# EAGLE design MCU_V3 (EAGLE 7.6.0)
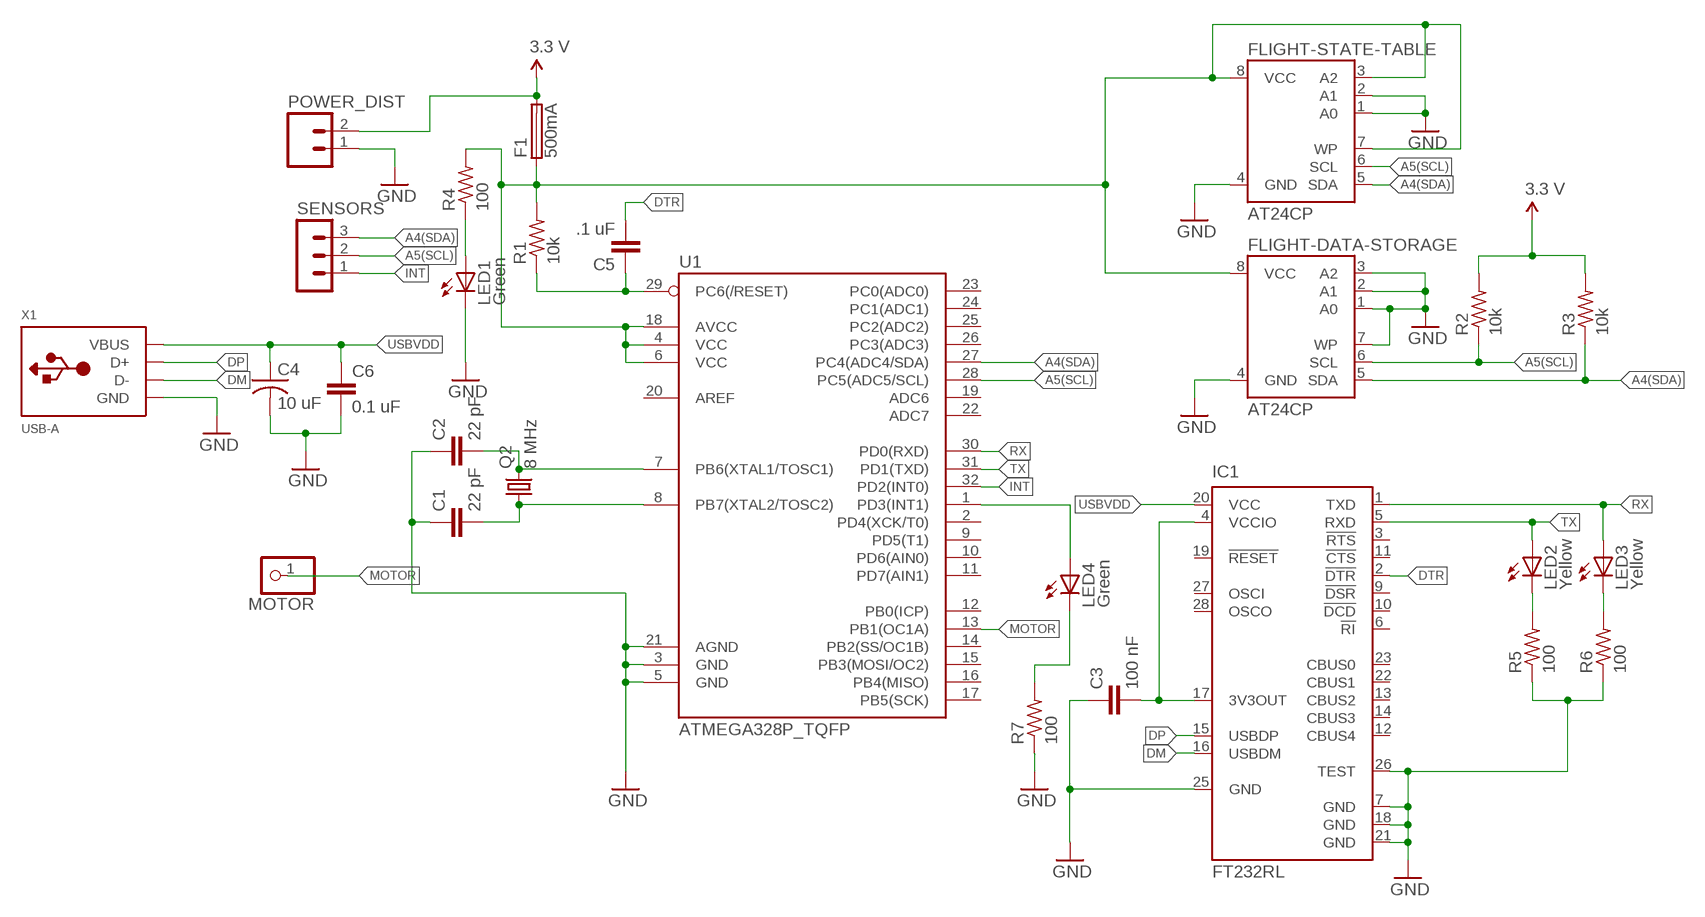
[diagram p0: schematic, sheet 1]

## Parts
C1  22 pF  C2,5-3  [C2.5-3]
C2  22 pF  C2,5-3  [C2.5-3]
C3  100 nF  C2,5-3  [C2.5-3]
C4  10 uF  C-US025-024X044  [C025-024X044]
C5  .1 uF  C2,5-3  [C2.5-3]
C6  0.1 uF  C2,5-3  [C2.5-3]
F1  500mA  PICOFUSE  [PICOFUSE]
FLIGHT-DATA-STORAGE  AT24CP  [DIL08]
FLIGHT-STATE-TABLE  AT24CP  [DIL08]
IC1  FT232RL  [SSOP28]
LED1  Green  LED_ESML0603  [LED_SML0603]
LED2  Yellow  LED_ESML0603  [LED_SML0603]
LED3  Yellow  LED_ESML0603  [LED_SML0603]
LED4  Green  LED_ESML0603  [LED_SML0603]
MOTOR  PINHD-1X1  [1X01]
POWER_DIST  M02PTH  [1X02]
Q2  8 MHz  CRYSTALHC49S  [HC49/S]
R1  10k  R-US_R0805  [R0805]
R2  10k  R-US_R0805  [R0805]
R3  10k  R-US_R0805  [R0805]
R4  100  R-US_R0805  [R0805]
R5  100  R-US_R0805  [R0805]
R6  100  R-US_R0805  [R0805]
R7  100  R-US_R0805  [R0805]
SENSORS  MA03-1  [MA03-1]
U1  ATMEGA328P_TQFP  [TQFP32-08]
X1  USB-A  [MOLEX_480371000]

## Nets
A4(SDA): FLIGHT-DATA-STORAGE.5(SDA) FLIGHT-STATE-TABLE.5(SDA) R3.1 SENSORS.3 U1.27(PC4(ADC4/SDA))
A5(SCL): FLIGHT-DATA-STORAGE.6(SCL) FLIGHT-STATE-TABLE.6(SCL) R2.1 SENSORS.2 U1.28(PC5(ADC5/SCL))
DM: IC1.16(USBDM) X1.2(D-)
DP: IC1.15(USBDP) X1.3(D+)
DTR: C5.2 IC1.2(!DTR)
GND: C1.1 C2.1 C3.1 C4.2 C6.2 FLIGHT-DATA-STORAGE.1(A0) FLIGHT-DATA-STORAGE.2(A1) FLIGHT-DATA-STORAGE.3(A2) FLIGHT-DATA-STORAGE.4(GND) FLIGHT-DATA-STORAGE.7(WP) FLIGHT-STATE-TABLE.1(A0) FLIGHT-STATE-TABLE.2(A1) FLIGHT-STATE-TABLE.4(GND) IC1.7(GND) IC1.18(GND) IC1.21(GND) IC1.25(GND) IC1.26(TEST) LED1.C POWER_DIST.1 R5.1 R6.1 R7.1 U1.3(GND) U1.5(GND) U1.21(AGND) X1.4(GND)
INT: SENSORS.1 U1.32(PD2(INT0))
MOTOR: MOTOR.1 U1.13(PB1(OC1A))
N$1: C5.1 R1.1 U1.29(PC6(/RESET))
N$2: C2.2 Q2.2 U1.7(PB6(XTAL1/TOSC1))
N$3: C1.2 Q2.1 U1.8(PB7(XTAL2/TOSC2))
N$4: LED4.A U1.1(PD3(INT1))
N$5: F1.1 FLIGHT-DATA-STORAGE.8(VCC) FLIGHT-STATE-TABLE.3(A2) FLIGHT-STATE-TABLE.7(WP) FLIGHT-STATE-TABLE.8(VCC) R1.2 R4.2 U1.4(VCC) U1.6(VCC) U1.18(AVCC)
N$6: LED1.A R4.1
N$7: C3.2 IC1.4(VCCIO) IC1.17(3V3OUT)
N$8: LED4.C R7.2
N$9: LED2.C R5.2
N$10: LED3.C R6.2
RX: IC1.1(TXD) LED3.A U1.30(PD0(RXD))
TX: IC1.5(RXD) LED2.A U1.31(PD1(TXD))
USBVDD: C4.1 C6.1 IC1.20(VCC) X1.1(VBUS)
VDD: F1.2 POWER_DIST.2 R2.2 R3.2 ; supply symbol labelled 3.3 V
Unconnected: IC1.3(!RTS) IC1.6(!RI) IC1.9(!DSR) IC1.10(!DCD) IC1.11(!CTS) IC1.12(CBUS4) IC1.13(CBUS2) IC1.14(CBUS3) IC1.19(!RESET) IC1.22(CBUS1) IC1.23(CBUS0) IC1.27(OSCI) IC1.28(OSCO) U1.2(PD4(XCK/T0)) U1.9(PD5(T1)) U1.10(PD6(AIN0)) U1.11(PD7(AIN1)) U1.12(PB0(ICP)) U1.14(PB2(SS/OC1B)) U1.15(PB3(MOSI/OC2)) U1.16(PB4(MISO)) U1.17(PB5(SCK)) U1.19(ADC6) U1.20(AREF) U1.22(ADC7) U1.23(PC0(ADC0)) U1.24(PC1(ADC1)) U1.25(PC2(ADC2)) U1.26(PC3(ADC3))

## Library data of the parts
C1-C3 C5 C6 = capacitor-wima:C: CAPACITOR naming: grid - package width
C4 = adafruit:C-US: CAPACITOR, American symbol
F1 = fuse:PICOFUSE: PICOFUSE 19275, Wickmann; OC_FARNELL: unknown; OC_NEWARK: unknown
FLIGHT-DATA-STORAGE FLIGHT-STATE-TABLE = atmel:AT24C*: 2-wire serial EEPROM; MPN: AT24C1024BW-SH-B; OC_FARNELL: 1362646; OC_NEWARK: 03P2044
IC1 = ftdichip:FT232R: Source: http://www.ftdichip.com/Documents/DataSheets/DS_FT232R_v104.pdf; MPN: FT232RL; OC_FARNELL: 1146032; OC_NEWARK: 91K9918
LED1-LED4 = eagle-ltspice:LED_E: LED Source: http://www.osram.convergy.de Source: www.luxeon.com Source: www.kingbright.com; SPICEMODEL: NONE; SPICEPREFIX: D; SPICETYPE: diode
MOTOR = adafruit:PINHD-1X1: Pin header 1x1 for 0.1" spacing With round pins
POWER_DIST = SparkFun-Connectors:M02: Standard 2-pin 0.1" header. Use with - straight break away headers ( PRT-00116) - right angle break away headers (PRT-00553) - swiss pins (PRT-00743) - machine pins (PRT-00117) - female headers (PRT-00115) Molex polarized connector foot print use with: PRT-08233 with associated crimp pins and housings. 2.54_SCREWTERM for use with PRT-10571. 3.5mm Screw Terminal footprints for PRT-08084 5mm Screw Terminal footprints for use with PRT-08432
Q2 = adafruit:CRYSTAL: CRYSTAL; OC_FARNELL: 1667008; OC_NEWARK: unknown
R1-R7 = resistor:R-US_: RESISTOR, American symbol
SENSORS = con-lstb:MA03-1: PIN HEADER; OC_FARNELL: unknown; OC_NEWARK: unknown
U1 = SparkFun-DigitalIC:ATMEGA328P_TQFP; PROD_ID: IC-09069
X1 = adafruit:USB-A: USB type A 'plug' Used for things that can directly connect to a USB port, say USB key

## Board
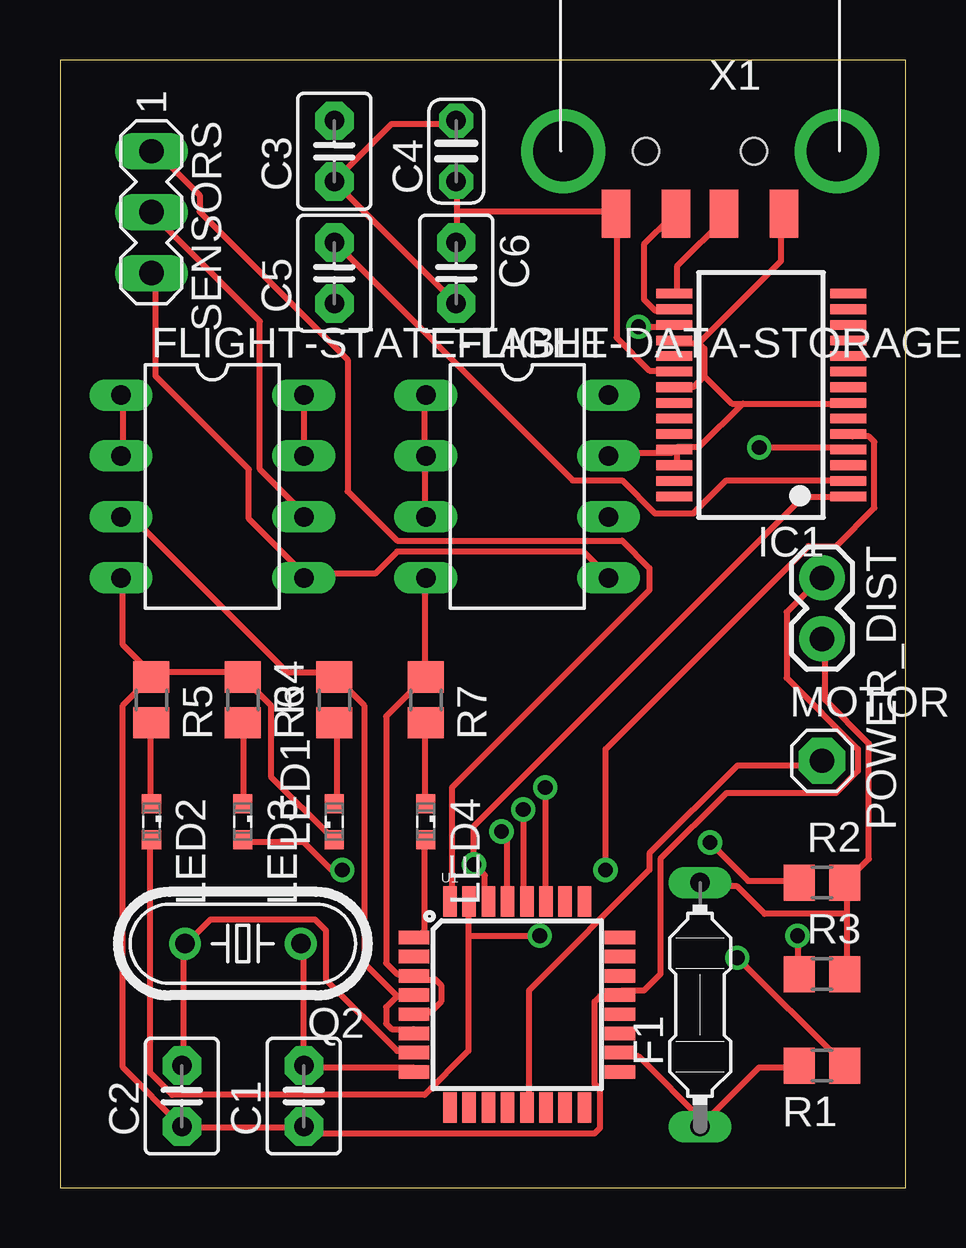
[diagram p1: board, top side]
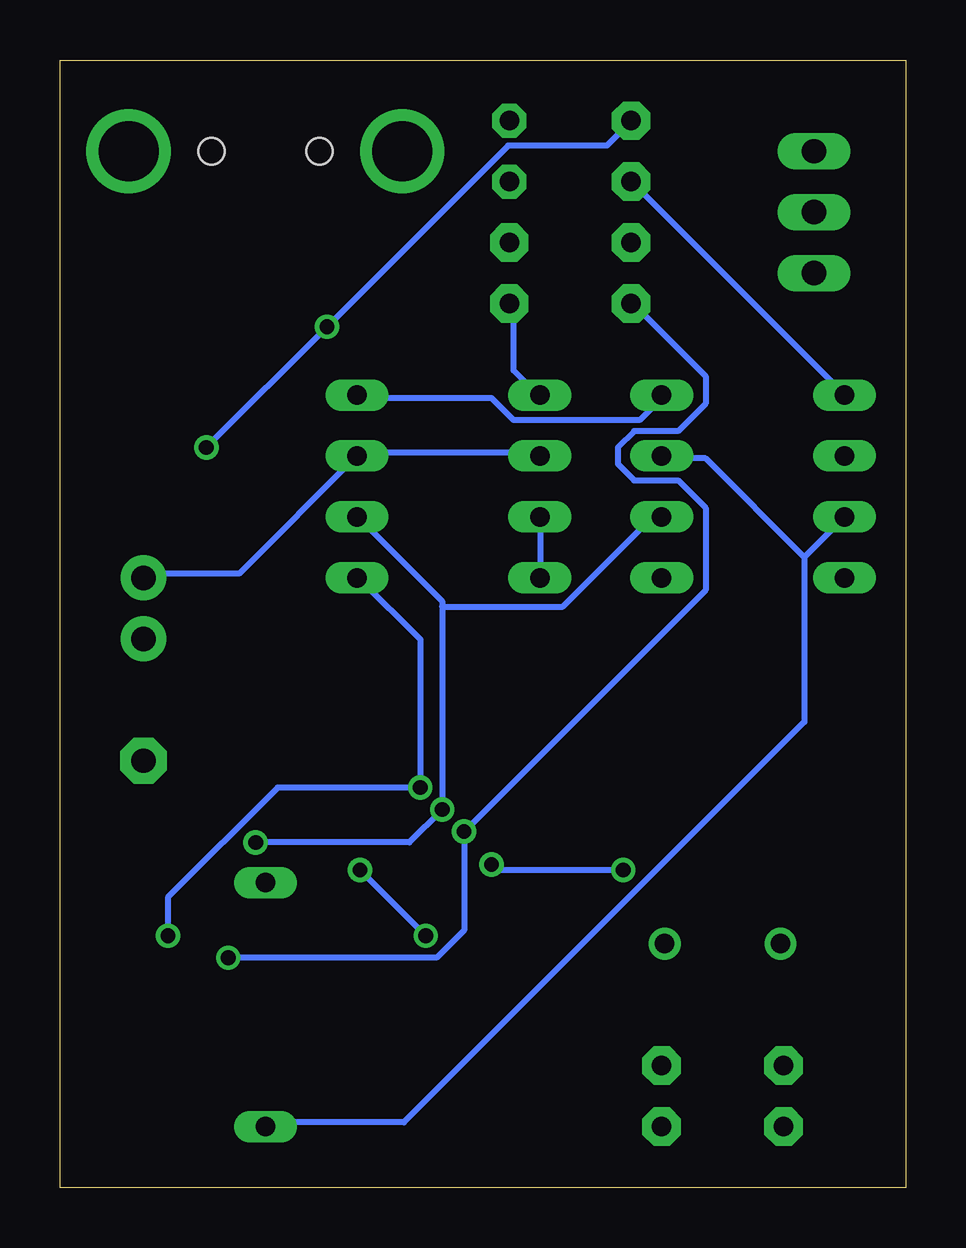
[diagram p2: board, bottom side, seen from below]

Size 35.23 x 46.98 mm. Coordinates in mm from the lower left corner, seen from the top.
Outline: 0,0 35.23,0 35.23,46.98 0,46.98 0,0
Copper layers (1*16): Top 0.035mm / dielectric 1.5mm / Bottom 0.035mm
Design rules "default": minimum track width 10mil, minimum drill 24mil, track to track 8mil, track to pad 8mil, pad to pad 8mil, via to via 8mil, smd to smd 8mil, copper to edge 40mil, drill to drill 8mil, minimum pad ring 10mil, minimum via ring 8mil, stop-mask expansion 4mil, vias tented up to drill 0mil, thermal gap 10mil

### Footprints (pad centres in the part's own frame; a part is rotated, then mirrored left to right if it is on the bottom)
C2.5-3 = drill 0.813 pad 1.6 octagon: 1 -1.27,0; 2 1.27,0
C025-024X044 = drill 0.813 pad 1.422 octagon: 1 -1.27,0; 2 1.27,0
PICOFUSE = drill 0.813 long: 1 -5.08,0; 2 5.08,0
DIL08 = drill 0.813 long: 1 -3.81,-3.81; 2 -1.27,-3.81; 3 1.27,-3.81; 4 3.81,-3.81; 5 3.81,3.81; 6 1.27,3.81; 7 -1.27,3.81; 8 -3.81,3.81
SSOP28 = smd 0.4 x 1.5: 1 -4.225,-3.625; 2 -3.575,-3.625; 3 -2.925,-3.625; 4 -2.275,-3.625; 5 -1.625,-3.625; 6 -0.975,-3.625; 7 -0.325,-3.625; 8 0.325,-3.625; 9 0.975,-3.625; 10 1.625,-3.625; 11 2.275,-3.625; 12 2.925,-3.625; 13 3.575,-3.625; 14 4.225,-3.625; 15 4.225,3.625; 16 3.575,3.625; 17 2.925,3.625; 18 2.275,3.625; 19 1.625,3.625; 20 0.975,3.625; 21 0.325,3.625; 22 -0.325,3.625; 23 -0.975,3.625; 24 -1.625,3.625; 25 -2.275,3.625; 26 -2.925,3.625; 27 -3.575,3.625; 28 -4.225,3.625
LED_SML0603 = smd 0.8 x 0.8: A 0.75,0; C -0.75,0
1X01 = drill 1.016 pad 1.93 octagon: 1 0,0
1X02 = drill 1.016 pad 1.88: 1 0,0; 2 2.54,0
HC49/S = drill 0.813: 1 -2.413,0; 2 2.413,0
R0805 = smd 1.3 x 1.5: 1 -0.95,0; 2 0.95,0
MA03-1 = drill 1.016 long: 1 -2.54,0; 2 0,0; 3 2.54,0
TQFP32-08 = smd 1.27 x 0.559: 1 -4.293,2.8; 2 -4.293,2; 3 -4.293,1.2; 4 -4.293,0.4; 5 -4.293,-0.4; 6 -4.293,-1.2; 7 -4.293,-2; 8 -4.293,-2.8; 17 4.293,-2.8; 18 4.293,-2; 19 4.293,-1.2; 20 4.293,-0.4; 21 4.293,0.4; 22 4.293,1.2; 23 4.293,2; 24 4.293,2.8 | smd 0.559 x 1.27: 9 -2.8,-4.293; 10 -2,-4.293; 11 -1.2,-4.293; 12 -0.4,-4.293; 13 0.4,-4.293; 14 1.2,-4.293; 15 2,-4.293; 16 2.8,-4.293; 25 2.8,4.293; 26 2,4.293; 27 1.2,4.293; 28 0.4,4.293; 29 -0.4,4.293; 30 -1.2,4.293; 31 -2,4.293; 32 -2.8,4.293
MOLEX_480371000 = smd 1.2 x 2: 1 3.5,2.6; 2 1,2.6; 3 -1,2.6; 4 -3.5,2.6 | drill 2.5: M1 -5.7,0; M2 5.7,0 | hole 1.1: -2.25,0; 2.25,0

### Placement (x,y rotation side)
C1  10.16,3.81 90 top
C2  5.08,3.81 90 top
C3  11.43,43.18 90 top
C4  16.51,43.18 90 top
C5  11.43,38.1 90 top
C6  16.51,38.1 270 top
F1  26.67,7.62 90 top
FLIGHT-DATA-STORAGE  19.05,29.21 270 top
FLIGHT-STATE-TABLE  6.35,29.21 270 top
IC1  29.21,33.02 90 top
LED1  11.43,15.24 90 top
LED2  3.81,15.24 270 top
LED3  7.62,15.24 270 top
LED4  15.24,15.24 270 top
MOTOR  31.75,17.78 0 top
POWER_DIST  31.75,25.4 270 top
Q2  7.62,10.16 180 top
R1  31.75,5.08 180 top
R2  31.75,12.7 0 top
R3  31.75,8.89 0 top
R4  11.43,20.32 90 top
R5  3.81,20.32 270 top
R6  7.62,20.32 270 top
R7  15.24,20.32 270 top
SENSORS  3.81,40.64 270 top
U1  19.05,7.62 0 top
X1  26.67,43.18 180 top

### Tracks (layer width: path | path; a pad name or v marks a point on that pad's centre or on a via)
A4(SDA)  (via drill 0.61)
  Top 0.254: v20.22,16.66 20.22,12.09 U1.27 | v30.73,10.49 30.73,8.89 R3.1 | 10.16,25.58 13.13,25.58 14.05,26.49 21.82,26.49 22.73,25.58 FLIGHT-DATA-STORAGE.5 | 10.16,25.58 7.87,27.86 7.87,29.92 3.99,33.81 3.99,37.92 SENSORS.3 | 10.16,25.58 FLIGHT-STATE-TABLE.5
  Bottom 0.254: FLIGHT-DATA-STORAGE.5 22.73,25.35 20.22,22.84 v20.22,16.66 26.16,16.66 30.73,12.09 v30.73,10.49
A5(SCL)  (via drill 0.61)
  Top 0.254: v19.3,15.75 19.3,12.09 U1.28 | v27.08,14.38 28.68,12.78 30.73,12.78 R2.1 | SENSORS.2 3.99,40.44 8.33,36.09 8.33,29.92 10.16,28.09 FLIGHT-STATE-TABLE.6
  Bottom 0.254: 19.3,24.21 19.3,24.44 22.73,27.86 FLIGHT-DATA-STORAGE.6 | 19.3,24.21 v19.3,15.75 20.68,14.38 v27.08,14.38 | 19.3,24.21 14.28,24.21 10.62,27.86 10.16,27.86 FLIGHT-STATE-TABLE.6
DM
  Top 0.254: IC1.16 25.48,36.55 24.79,36.55 24.33,37.01 24.33,39.29 25.48,40.44 X1.2
DP
  Top 0.254: IC1.15 25.71,37.24 25.71,38.38 27.76,40.44 X1.3
DTR
  Top 0.254: IC1.2 32.79,29.46 27.76,29.46 26.39,28.09 24.79,28.09 23.42,29.46 21.36,29.46 11.53,39.29 C5.2
GND
  Top 0.254: LED1.C 11.3,14.61 8.79,17.12 8.79,20.09 7.64,21.23 R6.1 7.42,21.46 3.99,21.46 R5.1 | FLIGHT-STATE-TABLE.4 2.62,25.35 2.62,22.61 3.76,21.46 R5.1 | 10.16,2.49 10.39,2.26 22.28,2.26 22.5,2.49 22.5,4.09 22.28,4.32 22.28,7.75 22.5,7.98 23.19,7.98 U1.21 23.42,8.2 24.33,8.2 25.02,8.89 25.02,13.69 27.76,16.43 32.33,16.43 33.25,17.35 33.25,18.26 30.28,21.23 30.28,23.98 31.65,25.35 POWER_DIST.1 | 10.16,2.49 5.13,2.49 C2.1 2.62,5 2.62,20.09 3.76,21.23 R5.1 | 10.16,2.49 C1.1 | FLIGHT-STATE-TABLE.2 2.62,30.61 2.62,32.89 FLIGHT-STATE-TABLE.1 | C4.2 16.33,44.32 13.82,44.32 11.53,42.04 C3.1 C6.2 | IC1.26 25.71,30.15 25.71,30.61 IC1.25 | IC1.25 25.48,30.61 22.96,30.61 FLIGHT-DATA-STORAGE.7 | 26.85,33.81 26.39,33.35 25.71,33.35 IC1.21 | 26.85,33.81 26.85,34.95 26.62,35.18 | 26.62,35.18 25.71,35.18 IC1.18 | 28.45,32.66 27.99,32.66 26.85,33.81 | 28.45,32.66 32.79,32.66 IC1.7 | 26.62,35.18 30.05,38.61 30.05,40.44 X1.4 | 28.45,32.66 26.62,30.84 25.71,30.84 IC1.25 | FLIGHT-DATA-STORAGE.3 15.19,28.09 15.19,30.38 FLIGHT-DATA-STORAGE.2 15.19,30.61 15.19,32.89 FLIGHT-DATA-STORAGE.1 | U1.5 14.96,7.29 15.42,7.29 15.88,7.75 15.88,8.43 15.65,8.66 14.96,8.66 U1.3 14.73,8.89 14.05,8.89 13.59,9.35 13.59,19.63 15.19,21.23 R7.1 15.19,21.46 15.19,25.35 FLIGHT-DATA-STORAGE.4
  Bottom 0.254: FLIGHT-STATE-TABLE.1 2.62,33.12 11.3,41.81 C3.1 | POWER_DIST.1 31.65,25.58 27.76,25.58 FLIGHT-DATA-STORAGE.7 22.73,30.61 15.42,30.61 FLIGHT-DATA-STORAGE.2 | C6.2 16.33,36.78 16.33,34.04 15.42,33.12 FLIGHT-DATA-STORAGE.1 | FLIGHT-DATA-STORAGE.3 15.19,27.86 15.19,25.58 FLIGHT-DATA-STORAGE.4
INT
  Top 0.254: U1.32 16.33,12.09 16.33,16.66 24.56,24.89 24.56,25.81 23.42,26.95 14.05,26.95 11.99,29.01 11.99,34.49 5.82,40.66 5.82,41.35 3.99,43.18 SENSORS.1
MOTOR
  Top 0.254: U1.13 19.53,3.4 19.53,8.2 24.56,13.23 24.56,13.92 28.22,17.58 31.65,17.58 MOTOR.1
N$1  (via drill 0.61)
  Top 0.254: v18.39,14.83 18.62,14.61 18.62,12.09 U1.29 | v28.22,9.58 32.56,5.23 R1.1
  Bottom 0.254: C5.1 11.3,36.78 8.33,33.81 8.33,32.66 9.47,31.52 11.3,31.52 11.99,30.84 11.99,30.15 11.3,29.46 9.47,29.46 8.33,28.32 8.33,24.89 v18.39,14.83 18.39,10.72 19.53,9.58 v28.22,9.58
N$2
  Top 0.254: U1.7 14.73,5.69 14.05,5.69 11.07,8.66 11.07,10.72 10.62,11.18 6.27,11.18 5.36,10.26 Q2.2 5.13,10.03 5.13,5.23 C2.2
N$3
  Top 0.254: U1.8 14.73,5 10.16,5 C1.2 10.16,10.03 Q2.1
N$4
  Top 0.254: LED4.A 15.19,14.38 15.19,10.72 14.96,10.49 U1.1
N$5
  Top 0.254: FLIGHT-STATE-TABLE.8 FLIGHT-STATE-TABLE.7 | 26.85,2.72 24.11,5.46 23.42,5.46 U1.18 | 26.85,2.72 29.13,5 30.73,5 R1.2 | 26.85,2.72 F1.1 | 14.05,7.98 13.59,7.52 13.59,6.83 13.82,6.6 14.73,6.6 U1.6 | 14.05,7.98 14.73,7.98 U1.4 | FLIGHT-STATE-TABLE.3 2.62,27.86 3.07,27.86 9.47,21.46 11.3,21.46 R4.2 11.53,21.23 12.68,20.09 12.68,9.35 14.05,7.98
  Bottom 0.254: FLIGHT-DATA-STORAGE.8 22.73,32.89 17.25,32.89 16.33,31.98 11.07,31.98 10.16,32.89 FLIGHT-STATE-TABLE.8 | 4.22,26.26 4.22,19.41 20.9,2.72 26.62,2.72 F1.1 | FLIGHT-STATE-TABLE.3 4.22,26.26 | 4.22,26.26 8.33,30.38 10.16,30.38 FLIGHT-STATE-TABLE.7
N$6
  Top 0.254: LED1.A 11.53,16.2 11.53,19.18 R4.1
N$7  (via drill 0.61)
  Top 0.254: v24.11,35.87 25.48,35.87 IC1.17 | v29.13,30.84 32.79,30.84 IC1.4
  Bottom 0.254: C3.2 11.53,44.32 12.45,43.41 16.56,43.41 v24.11,35.87 v29.13,30.84
N$8
  Top 0.254: LED4.C 15.19,16.2 15.19,19.18 R7.2
N$9
  Top 0.254: LED2.C 3.76,16.2 3.76,19.18 R5.2
N$10
  Top 0.254: LED3.C 7.64,16.2 7.64,19.18 R6.2
RX  (via drill 0.61)
  Top 0.254: v11.76,13.23 11.3,13.23 10.16,14.38 7.64,14.38 LED3.A | U1.30 17.7,12.09 17.7,13.01 v17.25,13.46 17.25,15.06 30.96,28.78 32.79,28.78 IC1.1
  Bottom 0.254: v11.76,13.23 17.02,13.23 v17.25,13.46
TX  (via drill 0.61)
  Top 0.254: 17.02,10.49 17.02,11.86 U1.31 | 17.02,10.49 17.02,5.69 15.19,3.86 4.67,3.86 3.76,4.78 3.76,14.38 LED2.A | v22.73,13.23 22.73,18.26 31.19,26.72 32.33,26.72 33.93,28.32 33.93,31.06 33.71,31.29 33.02,31.29 IC1.5 | 17.02,10.49 v19.99,10.49
  Bottom 0.254: v19.99,10.49 v22.73,13.23
USBVDD
  Top 0.254: 16.56,40.66 16.56,39.52 C6.1 | 16.56,40.66 16.56,41.81 C4.1 | IC1.20 25.48,34.04 24.56,34.04 23.19,35.41 23.19,40.44 X1.1 22.96,40.66 16.56,40.66
VDD
  Top 0.254: 32.79,11.41 32.79,12.55 R2.2 32.79,12.78 33.71,13.69 33.71,18.49 31.88,20.32 31.88,22.84 POWER_DIST.2 | 32.79,11.41 32.79,8.89 R3.2 | 32.79,11.41 29.36,11.41 28.22,12.55 26.85,12.55 F1.2